# Altium project STEPPER_CONNECTOR.PrjPcb
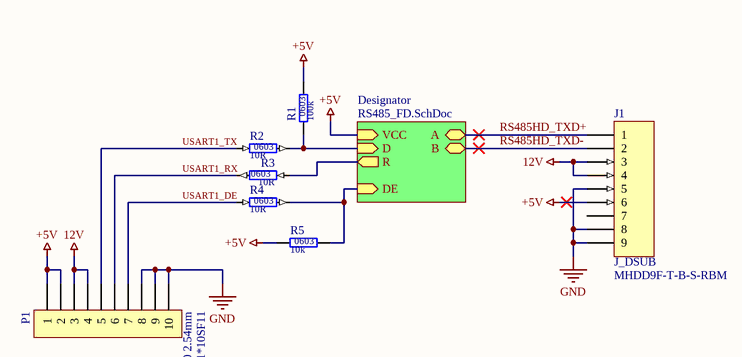
[diagram p0: top.SchDoc]
2 sheets, 11 parts. Net scope: hierarchical (ports join the sheet entries above them; power ports are global).
Board file: PCB.PcbDoc
Sheets:
  top.SchDoc
    Designator = RS485_FD.SchDoc

## Sheet top.SchDoc
size A4

### Parts
J1  value MHDD9F-T-B-S-RBM  [J_DSUB_MHDD9F-T-B-S-RBM]  (hidden comment: DSUB 9 Pin)
P1  value DS1021-1*10SF11  SCH_Footprint: 1x10 2.54mm  [P_HEADER_1x10_2.54]  (hidden comment: Goldpin)
R1  value 100k  SCH_Footprint: 0603  [R_0603_1608]  (hidden comment: Resistor)
R2  value 10R  SCH_Footprint: 0603  [R_0603_1608]  (hidden comment: Resistor)
R3  value 10R  SCH_Footprint: 0603  [R_0603_1608]  (hidden comment: Resistor)
R4  value 10R  SCH_Footprint: 0603  [R_0603_1608]  (hidden comment: Resistor)
R5  value 10k  SCH_Footprint: 0603  [R_0603_1608]  (hidden comment: Resistor)

### Sub-sheets
Designator = RS485_FD.SchDoc: VCC (in), R (out), D (in), DE (in), A (bidir), B (bidir)

### Nets
12V: J1.3 J1.4 P1.3 P1.4
+5V: J1.6 P1.1 P1.2 R1.2 R5.1 ; sheet Designator/VCC
GND: J1.5 J1.8 J1.9 P1.8 P1.9 P1.10
RS485HD_TXD+: J1.1 ; sheet Designator/A
RS485HD_TXD-: J1.2 ; sheet Designator/B
USART1_DE: P1.7 R4.1
USART1_RX: P1.6 R3.2
USART1_TX: P1.5 R2.1
NetR1_1: R1.1 R2.2 ; sheet Designator/D
NetR3_1: R3.1 ; sheet Designator/R
NetR4_2: R4.2 R5.2 ; sheet Designator/DE

Not connected (* = marked no-connect by the designer): J1 0(NC) 7

### Library data of the parts
J1 = J_DSUB: Header, 9-Pin; SCH_Footprint: J_DSUB; Part Number: J_DSUB; Component Type: Standard; HelpURL: https://www.tme.eu/Document/d24efe21bdaa08410b5ca50a678e1de1/MHDDXX-F-T-B-S-RBM.PDF; Manufacturer: -; Manufacturer Part Number: MHDD9F-T-B-S-RBM; Supplier 1: TME; Supplier Part Number 1: MHDD9F-T-B-S-RBM; Supplier 2: RS Components; Supplier 3: Farnell; Supplier Part Number 3: 2533067; Supplier 4: Mouser; Supplier 5: Digi-Key
P1 = P_HEADER_1x10_2.54: Pin Header; Manufacturer: Connfly; Part Number: P_HEADER_1x10_2.54; Component Type: Standard; HelpURL: http://www.tme.eu/en/Document/cc301e58a5da78cb543a94b5a5b7f06a/DS1021.pdf; Manufacturer Part Number: DS1021-1*10SF11; Supplier 1: TME; Supplier Part Number 1: ZL201-10G; Supplier 2: RS Components; Supplier 3: Farnell; Supplier 4: Mouser; Supplier 5: Digi-Key
R1 = R_100k_0603_1: Manufacturer: Royalohm; Manufacturer Part Number: 0603SAF1003T5E; Voltage: 50V; Power: 100mW; Tolerance: 1%; Part Number: R_100k_0603_1; HelpURL: http://www.tme.eu/pl/Document/b315665a56acbc42df513c99b390ad98/ROYALOHM-THICKFILM.pdf; Supplier 1: TME; Supplier Part Number 1: SMD0603-100K-1%; Supplier 2: RS Components; Supplier 3: Farnell; Supplier 4: Mouser; Supplier Part Number 4: 667-ERJ-3EKF1003V; Supplier 5: Digi-Key; Supplier Part Number 5: P100KHCT-ND
R2-R4 = R_10R_0603_1: Manufacturer: Royalohm; Manufacturer Part Number: 0603SAF100JT5E; Voltage: 50V; Power: 100mW; Tolerance: 1%; Part Number: R_10R_0603_1; HelpURL: http://www.tme.eu/pl/Document/b315665a56acbc42df513c99b390ad98/ROYALOHM-THICKFILM.pdf; Supplier 1: TME; Supplier Part Number 1: SMD0603-10R-1%; Supplier 2: RS Components; Supplier 3: Farnell; Supplier 4: Mouser; Supplier 5: Digi-Key
R5 = R_10k_0603_1: Manufacturer: Vishay; Manufacturer Part Number: CRCW060310K0FKTABC; Voltage: 75V; Power: 100mW; Tolerance: 1%; Part Number: R_10k_0603_1; HelpURL: http://www.tme.eu/pl/Document/622e28308c06d160637f2b14751ba16b/Data%20Sheet%20CRCW_BCe3.pdf; Supplier 1: TME; Supplier Part Number 1: CRCW060310K0FKTABC; Supplier 2: RS Components; Supplier 3: Farnell; Supplier 4: Mouser; Supplier Part Number 4: 667-ERJ-3EKF1002V; Supplier 5: Digi-Key; Supplier Part Number 5: P10KGCT-ND

## Sheet RS485_FD.SchDoc
size A4
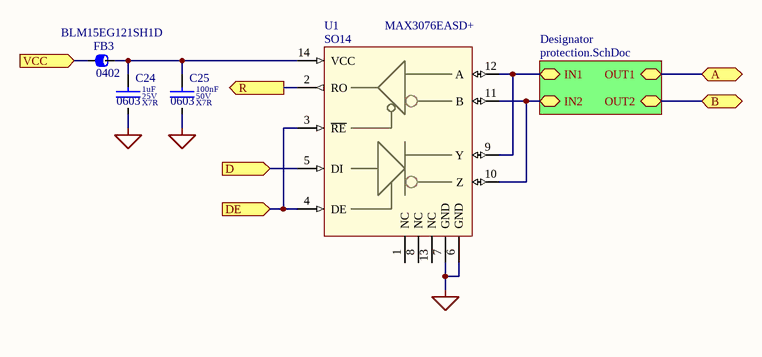
[diagram p1: RS485_FD.SchDoc]

### Parts
C24  value 1uF  Dielectric: X7R  Voltage: 25V  SCH_Footprint: 0603  [C_0603_1608]  (hidden comment: Ceramic X7R)
C25  value 100nF  Dielectric: X7R  Voltage: 50V  SCH_Footprint: 0603  [C_0603_1608]  (hidden comment: Ceramic X7R)
FB3  SCH_Footprint: 0402  Manufacturer Part Number: BLM15EG121SH1D  [FB_0402_1005]  (hidden comment: Ferrite bead)
U1  value MAX3076EASD+  SCH_Footprint: SO14  [SOP14_SO14_SOIC14_4X9X18]  (hidden comment: MAX3076 Series 16 Mbps 6 V Full Duplex SMT RS 485 Transceiver - SOIC-14)

### Sub-sheets
Designator = protection.SchDoc (file not in this document): OUT2 (bidir), IN1 (bidir), IN2 (bidir), OUT1 (bidir)

### Ports
A (bidir), B (bidir), D (in), DE (in), R (out), VCC (in)

### Nets
+5V: FB3.1 ; port VCC
GND: C24.2 C25.2 U1.6(GND) U1.7(GND)
RS485HD_TXD+: port A, sheet Designator/OUT1
RS485HD_TXD-: port B, sheet Designator/OUT2
NetC24_1: C24.1 C25.1 FB3.2 U1.14(VCC)
NetR1_1: U1.5(DI) ; port D
NetR3_1: U1.2(RO) ; port R
NetR4_2: U1.3(~{RE}) U1.4(DE) ; port DE
NetU1_9: U1.9(Y) U1.12(A) ; sheet Designator/IN1
NetU1_10: U1.10(Z) U1.11(B) ; sheet Designator/IN2

Not connected (* = marked no-connect by the designer): U1 1(NC) 8(NC) 13(NC)

### Library data of the parts
C24 = C_1uF_25V_X7R_0603_10: Capacitor; Manufacturer: Samsung; Manufacturer Part Number: CL10B105KA8NNNC; Tolerance (%): 10; Part Number: C_1uF_25V_X7R_0603_10; HelpURL: http://www.tme.eu/pl/Document/4a42202b32dab16128fe107dd69598cc/samsung-chip-cap.pdf; Supplier 1: TME; Supplier Part Number 1: CL10B105KA8NNNC; Supplier 2: RS Components; Supplier 3: Farnell; Supplier 4: Mouser; Supplier 5: Digi-Key
C25 = C_100nF_50V_X7R_0603_5: Capacitor; Manufacturer: Samsung; Manufacturer Part Number: CL10B104JB8NNNC; Tolerance (%): 5; Part Number: C_100nF_50V_X7R_0603_5; HelpURL: http://www.tme.eu/pl/Document/4a42202b32dab16128fe107dd69598cc/samsung-chip-cap.pdf; Supplier 1: TME; Supplier Part Number 1: CL10B104JB8NNNC; Supplier 2: RS Components; Supplier 3: Farnell; Supplier 4: Mouser; Supplier 5: Digi-Key
FB3 = FB_BLM15EG121SH1D: Manufacturer: Murata; Current: 1.5A; Resistance: 95mR; Part Number: FB_BLM15EG121SH1D; Value: BLM15EG121SH1D; HelpURL: http://datasheet.octopart.com/BLM15EG121SH1D-Murata-datasheet-37129980.pdf; Supplier 1: TME; Supplier 2: RS Components; Supplier 3: Farnell; Supplier 4: Mouser; Supplier Part Number 4: 81-BLM15EG121SH1D; Supplier 5: Digi-Key; Supplier Part Number 5: 490-17344-1-ND
U1 = U_MAX3076EASD+: RS-485/RS-422 Transceivers, +3.3V,  ±15kV ESD-Protected, Fail-Safe, Hot-Swap; Manufacturer: Maxim Integrated; Part Number: U_MAX3076EASD+; HelpURL: https://sigma.octopart.com/138901689/technical_drawing/Maxim-Integrated-MAX3076EASD%2B.pdf; Manufacturer Part Number: MAX3076EASD+; Supplier 1: TME; Supplier 2: RS Components; Supplier 3: Farnell; Supplier Part Number 3: 2511650; Supplier 4: Mouser; Supplier Part Number 4: 700-MAX3076EASD; Supplier 5: Digi-Key; Supplier Part Number 5: MAX3076EASD+-ND

## Nets that join several sheets
+5V: top (5 pins), RS485_FD (FB3.1)
GND: top (6 pins), RS485_FD (C24.2 C25.2 U1.6 U1.7)
NetR1_1: top (R1.1 R2.2), RS485_FD (U1.5)
NetR3_1: top (R3.1), RS485_FD (U1.2)
NetR4_2: top (R4.2 R5.2), RS485_FD (U1.3 U1.4)